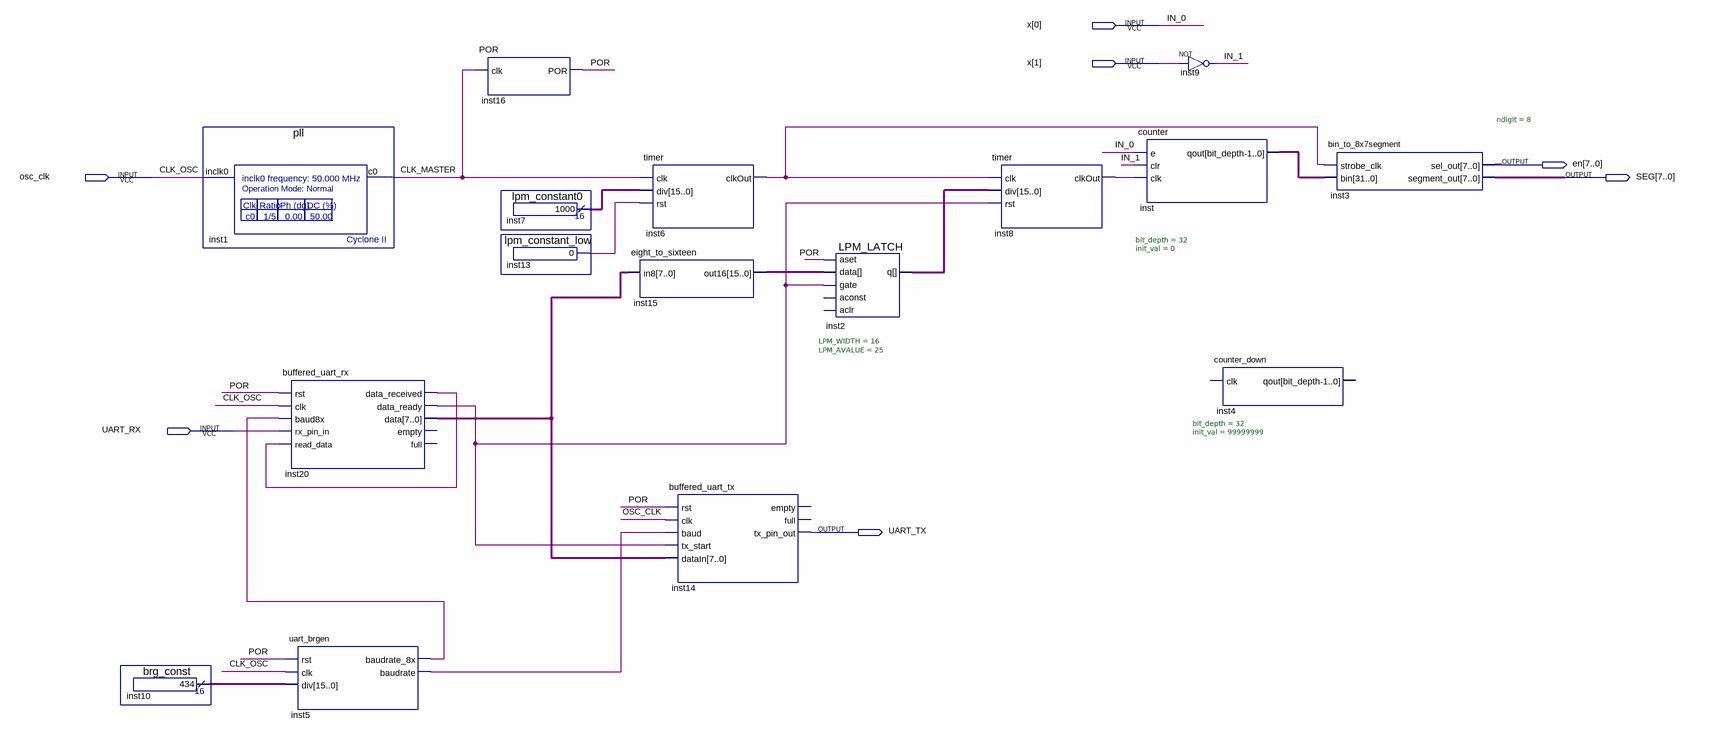
[diagram p0: schematic sheet]
// Quartus schematic FirstProject.bdf as structural Verilog: 16 symbols, 7 pins
module FirstProject (
  input  [1:0] x,
  input  osc_clk,
  input  UART_RX,
  output [7:0] en,
  output [7:0] SEG,
  output UART_TX
);

  wire CLK_MASTER, IN_1, inst5_baudrate, inst5_baudrate_8x, inst6_clkout, inst8_clkout, inst13_result,
       inst20_data_ready, inst20_data_received, POR;
  wire [7:0] inst20_data;
  wire [15:0] inst2_q, inst7_result, inst10_result, inst15_out16;
  wire [31:0] inst_qout;

  brg_const inst10 (.result(inst10_result));
  pll inst1 (.inclk0(osc_clk), .c0(CLK_MASTER));
  buffered_uart_rx inst20 (
    .rst(POR), .clk(osc_clk), .baud8x(inst5_baudrate_8x), .rx_pin_in(UART_RX),
    .read_data(inst20_data_received), .data_received(inst20_data_received), .data_ready(inst20_data_ready),
    .data(inst20_data));  // open: empty, full
  uart_brgen inst5 (
    .rst(POR), .clk(osc_clk), .div(inst10_result), .baudrate_8x(inst5_baudrate_8x), .baudrate(inst5_baudrate));
  POR inst16 (.clk(CLK_MASTER), .POR(POR));
  lpm_constant0 inst7 (.result(inst7_result));
  lpm_constant_low inst13 (.result(inst13_result));
  timer inst6 (.clk(CLK_MASTER), .div(inst7_result), .rst(inst13_result), .clkOut(inst6_clkout));
  eight_to_sixteen inst15 (.in8(inst20_data), .out16(inst15_out16));
  buffered_uart_tx inst14 (
    .rst(POR), .clk(osc_clk), .baud(inst5_baudrate), .tx_start(inst20_data_ready), .dataIn(inst20_data),
    .tx_pin_out(UART_TX));  // open: empty, full
  LPM_LATCH #(.LPM_WIDTH(16), .LPM_AVALUE(25)) inst2 (
    .aset(POR), .data(inst15_out16), .gate(inst20_data_ready), .q(inst2_q));  // open: aconst, aclr
  timer inst8 (.clk(inst6_clkout), .div(inst2_q), .rst(inst20_data_ready), .clkOut(inst8_clkout));
  counter #(.bit_depth(32), .init_val(0)) inst (.e(x[0]), .clr(IN_1), .clk(inst8_clkout), .qout(inst_qout));
  not inst9 (IN_1, x[1]);
  counter_down #(.bit_depth(32), .init_val(99999999)) inst4 ();  // open: clk, qout
  bin_to_8x7segment #(.ndigit(8)) inst3 (.strobe_clk(inst6_clkout), .bin(inst_qout), .sel_out(en), .segment_out(SEG));

  // Other names for the same wires on the sheet: CLK_OSC = osc_clk; IN_0 = x[0]
endmodule
